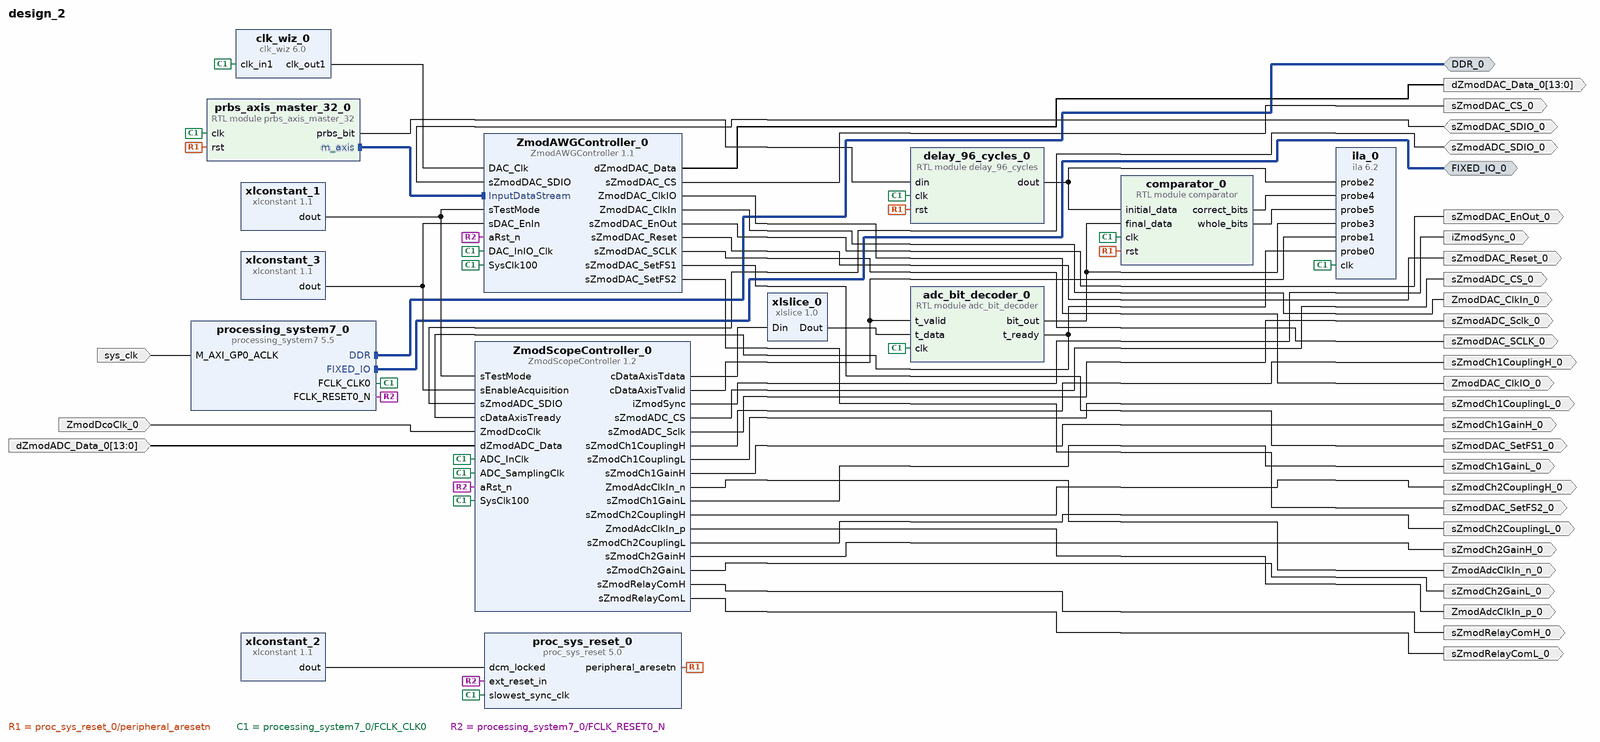
[diagram p0: block diagram of the top level]
# Vivado block design design_2, xc7z020clg484-1, Vivado 2024.2
create_bd_design design_2

create_bd_intf_port -mode Master -vlnv xilinx.com:interface:ddrx_rtl:1.0 DDR_0
create_bd_intf_port -mode Master -vlnv xilinx.com:display_processing_system7:fixedio_rtl:1.0 FIXED_IO_0
create_bd_port -dir IO sZmodADC_SDIO_0
create_bd_port -dir O sZmodADC_CS_0
create_bd_port -dir O sZmodADC_Sclk_0
create_bd_port -dir O iZmodSync_0
create_bd_port -dir O sZmodCh1CouplingH_0
create_bd_port -dir O sZmodCh1CouplingL_0
create_bd_port -dir O sZmodCh1GainH_0
create_bd_port -dir O sZmodCh1GainL_0
create_bd_port -dir O sZmodCh2CouplingH_0
create_bd_port -dir O sZmodCh2CouplingL_0
create_bd_port -dir O sZmodCh2GainH_0
create_bd_port -dir O sZmodCh2GainL_0
create_bd_port -dir O ZmodAdcClkIn_n_0
create_bd_port -dir O ZmodAdcClkIn_p_0
create_bd_port -dir I -type clk sys_clk
set_property -dict {CONFIG.FREQ_HZ 125000000} [get_bd_ports sys_clk]
create_bd_port -dir I -from 13 -to 0 dZmodADC_Data_0
create_bd_port -dir I -type clk ZmodDcoClk_0
create_bd_port -dir O sZmodRelayComH_0
create_bd_port -dir O sZmodRelayComL_0
create_bd_port -dir O sZmodDAC_CS_0
create_bd_port -dir O sZmodDAC_SCLK_0
create_bd_port -dir IO sZmodDAC_SDIO_0
create_bd_port -dir O -type rst sZmodDAC_Reset_0
create_bd_port -dir O -type clk ZmodDAC_ClkIO_0
create_bd_port -dir O -type clk ZmodDAC_ClkIn_0
create_bd_port -dir O -from 13 -to 0 dZmodDAC_Data_0
create_bd_port -dir O sZmodDAC_SetFS1_0
create_bd_port -dir O sZmodDAC_SetFS2_0
create_bd_port -dir O sZmodDAC_EnOut_0

create_bd_cell -type ip -vlnv xilinx.com:ip:ila:6.2 ila_0
set_property -dict [list \
  CONFIG.C_DATA_DEPTH 32768 \
  CONFIG.C_MONITOR_TYPE Native \
  CONFIG.C_NUM_OF_PROBES 6 \
  CONFIG.C_PROBE0_TYPE 1 \
  CONFIG.C_PROBE0_WIDTH 1 \
  CONFIG.C_PROBE1_TYPE 1 \
  CONFIG.C_PROBE1_WIDTH 1 \
  CONFIG.C_PROBE2_TYPE 1 \
  CONFIG.C_PROBE2_WIDTH 1 \
  CONFIG.C_PROBE3_TYPE 1 \
  CONFIG.C_PROBE3_WIDTH 1 \
  CONFIG.C_PROBE4_TYPE 1 \
  CONFIG.C_PROBE4_WIDTH 14 \
  CONFIG.C_PROBE5_TYPE 1 \
  CONFIG.C_PROBE5_WIDTH 14 \
  CONFIG.C_PROBE6_TYPE 1 \
  CONFIG.C_PROBE6_WIDTH 1 \
  CONFIG.C_PROBE7_WIDTH 1 \
  CONFIG.C_PROBE8_TYPE 1 \
  CONFIG.C_PROBE9_TYPE 1 \
] [get_bd_cells ila_0]
create_bd_cell -type module -reference adc_bit_decoder adc_bit_decoder_0
create_bd_cell -type ip -vlnv xilinx.com:ip:xlconstant:1.1 xlconstant_1
set_property -dict {CONFIG.CONST_VAL 0} [get_bd_cells xlconstant_1]
create_bd_cell -type ip -vlnv xilinx.com:ip:xlslice:1.0 xlslice_0
set_property -dict {CONFIG.DIN_FROM 14 CONFIG.DIN_TO 1 CONFIG.DOUT_WIDTH 14} [get_bd_cells xlslice_0]
create_bd_cell -type ip -vlnv xilinx.com:ip:xlconstant:1.1 xlconstant_3
create_bd_cell -type ip -vlnv xilinx.com:ip:processing_system7:5.5 processing_system7_0
set_property -dict {CONFIG.PCW_FPGA0_PERIPHERAL_FREQMHZ 50} [get_bd_cells processing_system7_0]
# 31 more settings of processing_system7_0 are not shown: defaults, MIO pin electricals, DDR timing, and values the tool derives
create_bd_cell -type ip -vlnv digilent.com:user:ZmodScopeController:1.2 ZmodScopeController_0
set_property -dict {CONFIG.kExtCalibEn false CONFIG.kExtRelayConfigEn false} [get_bd_cells ZmodScopeController_0]
create_bd_cell -type ip -vlnv digilent.com:user:ZmodAWGController:1.1 ZmodAWGController_0
create_bd_cell -type ip -vlnv xilinx.com:ip:clk_wiz:6.0 clk_wiz_0
set_property -dict [list \
  CONFIG.CLKOUT1_JITTER 192.113 \
  CONFIG.CLKOUT1_REQUESTED_OUT_FREQ 50 \
  CONFIG.CLKOUT1_REQUESTED_PHASE 90 \
  CONFIG.MMCM_CLKOUT0_DIVIDE_F 20.000 \
  CONFIG.MMCM_CLKOUT0_PHASE 90.000 \
  CONFIG.USE_LOCKED false \
  CONFIG.USE_RESET false \
] [get_bd_cells clk_wiz_0]
create_bd_cell -type ip -vlnv xilinx.com:ip:proc_sys_reset:5.0 proc_sys_reset_0
create_bd_cell -type ip -vlnv xilinx.com:ip:xlconstant:1.1 xlconstant_2
create_bd_cell -type module -reference prbs_axis_master_32 prbs_axis_master_32_0
create_bd_cell -type module -reference delay_96_cycles delay_96_cycles_0
set_property -dict {CONFIG.WIDTH 200} [get_bd_cells delay_96_cycles_0]
create_bd_cell -type module -reference comparator comparator_0

# ---- connections ----

connect_bd_intf_net [get_bd_intf_pins prbs_axis_master_32_0/m_axis] [get_bd_intf_pins ZmodAWGController_0/InputDataStream]
connect_bd_intf_net [get_bd_intf_ports DDR_0] [get_bd_intf_pins processing_system7_0/DDR]
connect_bd_intf_net [get_bd_intf_ports FIXED_IO_0] [get_bd_intf_pins processing_system7_0/FIXED_IO]
connect_bd_net [get_bd_ports sZmodADC_SDIO_0] [get_bd_pins ZmodScopeController_0/sZmodADC_SDIO]
connect_bd_net [get_bd_ports sZmodDAC_SDIO_0] [get_bd_pins ZmodAWGController_0/sZmodDAC_SDIO]
connect_bd_net [get_bd_pins ZmodAWGController_0/ZmodDAC_ClkIO] [get_bd_ports ZmodDAC_ClkIO_0]
connect_bd_net [get_bd_pins ZmodAWGController_0/ZmodDAC_ClkIn] [get_bd_ports ZmodDAC_ClkIn_0]
connect_bd_net [get_bd_pins ZmodAWGController_0/dZmodDAC_Data] [get_bd_ports dZmodDAC_Data_0]
connect_bd_net [get_bd_pins ZmodAWGController_0/sZmodDAC_CS] [get_bd_ports sZmodDAC_CS_0]
connect_bd_net [get_bd_pins ZmodAWGController_0/sZmodDAC_EnOut] [get_bd_ports sZmodDAC_EnOut_0]
connect_bd_net [get_bd_pins ZmodAWGController_0/sZmodDAC_Reset] [get_bd_ports sZmodDAC_Reset_0]
connect_bd_net [get_bd_pins ZmodAWGController_0/sZmodDAC_SCLK] [get_bd_ports sZmodDAC_SCLK_0]
connect_bd_net [get_bd_pins ZmodAWGController_0/sZmodDAC_SetFS1] [get_bd_ports sZmodDAC_SetFS1_0]
connect_bd_net [get_bd_pins ZmodAWGController_0/sZmodDAC_SetFS2] [get_bd_ports sZmodDAC_SetFS2_0]
connect_bd_net -net ZmodDcoClk_0_1 [get_bd_ports ZmodDcoClk_0] [get_bd_pins ZmodScopeController_0/ZmodDcoClk]
connect_bd_net [get_bd_pins ZmodScopeController_0/ZmodAdcClkIn_n] [get_bd_ports ZmodAdcClkIn_n_0]
connect_bd_net [get_bd_pins ZmodScopeController_0/ZmodAdcClkIn_p] [get_bd_ports ZmodAdcClkIn_p_0]
connect_bd_net [get_bd_pins ZmodScopeController_0/cDataAxisTdata] [get_bd_pins xlslice_0/Din]
connect_bd_net [get_bd_pins ZmodScopeController_0/cDataAxisTvalid] [get_bd_pins ila_0/probe1] [get_bd_pins adc_bit_decoder_0/t_valid]
connect_bd_net [get_bd_pins ZmodScopeController_0/iZmodSync] [get_bd_ports iZmodSync_0]
connect_bd_net [get_bd_pins ZmodScopeController_0/sZmodADC_CS] [get_bd_ports sZmodADC_CS_0]
connect_bd_net [get_bd_pins ZmodScopeController_0/sZmodADC_Sclk] [get_bd_ports sZmodADC_Sclk_0]
connect_bd_net [get_bd_pins ZmodScopeController_0/sZmodCh1CouplingH] [get_bd_ports sZmodCh1CouplingH_0]
connect_bd_net [get_bd_pins ZmodScopeController_0/sZmodCh1CouplingL] [get_bd_ports sZmodCh1CouplingL_0]
connect_bd_net [get_bd_pins ZmodScopeController_0/sZmodCh1GainH] [get_bd_ports sZmodCh1GainH_0]
connect_bd_net [get_bd_pins ZmodScopeController_0/sZmodCh1GainL] [get_bd_ports sZmodCh1GainL_0]
connect_bd_net [get_bd_pins ZmodScopeController_0/sZmodCh2CouplingH] [get_bd_ports sZmodCh2CouplingH_0]
connect_bd_net [get_bd_pins ZmodScopeController_0/sZmodCh2CouplingL] [get_bd_ports sZmodCh2CouplingL_0]
connect_bd_net [get_bd_pins ZmodScopeController_0/sZmodCh2GainH] [get_bd_ports sZmodCh2GainH_0]
connect_bd_net [get_bd_pins ZmodScopeController_0/sZmodCh2GainL] [get_bd_ports sZmodCh2GainL_0]
connect_bd_net [get_bd_pins ZmodScopeController_0/sZmodRelayComH] [get_bd_ports sZmodRelayComH_0]
connect_bd_net [get_bd_pins ZmodScopeController_0/sZmodRelayComL] [get_bd_ports sZmodRelayComL_0]
connect_bd_net [get_bd_pins adc_bit_decoder_0/bit_out] [get_bd_pins comparator_0/final_data] [get_bd_pins ila_0/probe3]
connect_bd_net [get_bd_pins adc_bit_decoder_0/t_ready] [get_bd_pins ZmodScopeController_0/cDataAxisTready] [get_bd_pins ila_0/probe0]
connect_bd_net [get_bd_pins clk_wiz_0/clk_out1] [get_bd_pins ZmodAWGController_0/DAC_Clk]
connect_bd_net [get_bd_pins comparator_0/correct_bits] [get_bd_pins ila_0/probe4]
connect_bd_net [get_bd_pins comparator_0/whole_bits] [get_bd_pins ila_0/probe5]
connect_bd_net -net dZmodADC_Data_0_1 [get_bd_ports dZmodADC_Data_0] [get_bd_pins ZmodScopeController_0/dZmodADC_Data]
connect_bd_net [get_bd_pins delay_96_cycles_0/dout] [get_bd_pins comparator_0/initial_data] [get_bd_pins ila_0/probe2]
connect_bd_net [get_bd_pins prbs_axis_master_32_0/prbs_bit] [get_bd_pins delay_96_cycles_0/din]
connect_bd_net [get_bd_pins proc_sys_reset_0/peripheral_aresetn] \
  [get_bd_pins delay_96_cycles_0/rst] [get_bd_pins comparator_0/rst] [get_bd_pins prbs_axis_master_32_0/rst]
connect_bd_net [get_bd_pins processing_system7_0/FCLK_CLK0] \
  [get_bd_pins ila_0/clk] [get_bd_pins ZmodScopeController_0/SysClk100] [get_bd_pins ZmodScopeController_0/ADC_SamplingClk] \
  [get_bd_pins ZmodScopeController_0/ADC_InClk] [get_bd_pins clk_wiz_0/clk_in1] [get_bd_pins ZmodAWGController_0/SysClk100] \
  [get_bd_pins ZmodAWGController_0/DAC_InIO_Clk] [get_bd_pins proc_sys_reset_0/slowest_sync_clk] \
  [get_bd_pins comparator_0/clk] [get_bd_pins delay_96_cycles_0/clk] [get_bd_pins adc_bit_decoder_0/clk] \
  [get_bd_pins prbs_axis_master_32_0/clk]
connect_bd_net [get_bd_pins processing_system7_0/FCLK_RESET0_N] \
  [get_bd_pins ZmodScopeController_0/aRst_n] [get_bd_pins ZmodAWGController_0/aRst_n] \
  [get_bd_pins proc_sys_reset_0/ext_reset_in]
connect_bd_net [get_bd_ports sys_clk] [get_bd_pins processing_system7_0/M_AXI_GP0_ACLK]
connect_bd_net [get_bd_pins xlconstant_1/dout] [get_bd_pins ZmodScopeController_0/sTestMode] [get_bd_pins ZmodAWGController_0/sTestMode]
connect_bd_net [get_bd_pins xlconstant_2/dout] [get_bd_pins proc_sys_reset_0/dcm_locked]
connect_bd_net [get_bd_pins xlconstant_3/dout] [get_bd_pins ZmodScopeController_0/sEnableAcquisition] [get_bd_pins ZmodAWGController_0/sDAC_EnIn]
connect_bd_net [get_bd_pins xlslice_0/Dout] [get_bd_pins adc_bit_decoder_0/t_data]

validate_bd_design
save_bd_design
